# EAGLE design Color-Experimentation (EAGLE 9.6.2)
Assembly variants: DEFAULT
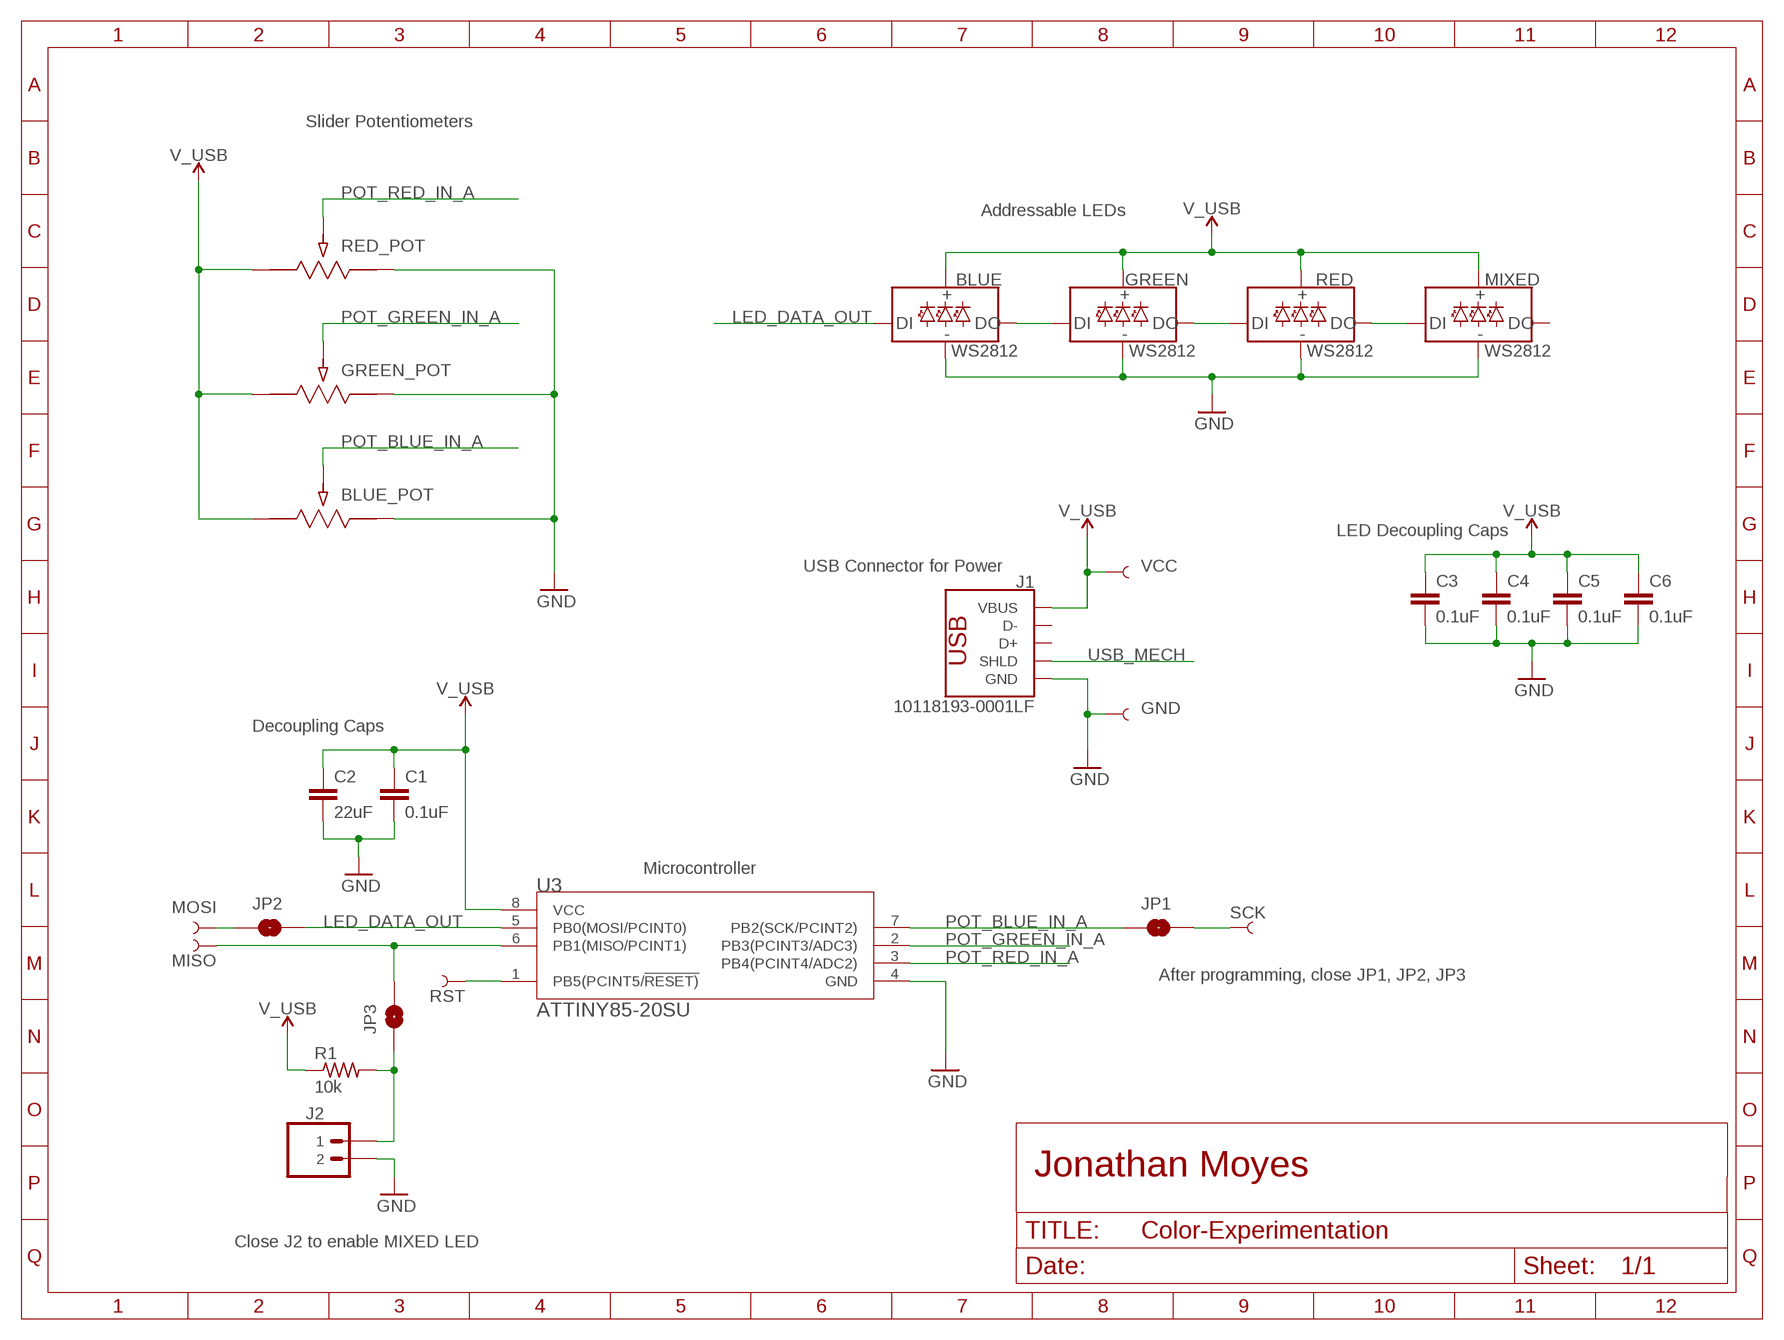
[diagram p0: schematic, sheet 1]

## Parts
BLUE  WS2812  WS2812_5050  [WS2812-5X5-4PIN]
BLUE_POT  10k  PTA2043-2015DPB103  [POT_PTA2043]
C1  0.1uF  CAP_0.1UF_25V_X7R-0603  [CAP_0603]
C2  22uF  CAP_22UF_16V_X5R-0603  [C0603]
C3  0.1uF  CAP_0.1UF_25V_X7R-0603  [CAP_0603]
C4  0.1uF  CAP_0.1UF_25V_X7R-0603  [CAP_0603]
C5  0.1uF  CAP_0.1UF_25V_X7R-0603  [CAP_0603]
C6  0.1uF  CAP_0.1UF_25V_X7R-0603  [CAP_0603]
GND  TEST-POINT40MIL  [TESTPOINT_40MIL_ROUND]  (not fitted in variant DEFAULT)
GREEN  WS2812  WS2812_5050  [WS2812-5X5-4PIN]
GREEN_POT  10k  PTA2043-2015DPB103  [POT_PTA2043]
J1  10118193-0001LF  [CONN_10118193-0001LF_AMP]
J2  CONN_02  [1X02]
JP1  JUMPER-SMT_2_NO_SILK  [SMT-JUMPER_2_NO_SILK]  (not fitted in variant DEFAULT)
JP2  JUMPER-SMT_2_NO_SILK  [SMT-JUMPER_2_NO_SILK]  (not fitted in variant DEFAULT)
JP3  JUMPER-SMT_2_NO_SILK  [SMT-JUMPER_2_NO_SILK]
MISO  TEST-POINT40MIL  [TESTPOINT_40MIL_ROUND]  (not fitted in variant DEFAULT)
MIXED  WS2812  WS2812_5050  [WS2812-5X5-4PIN]
MOSI  TEST-POINT40MIL  [TESTPOINT_40MIL_ROUND]  (not fitted in variant DEFAULT)
R1  10k  RES_10K_1%R0603  [R0603]
RED  WS2812  WS2812_5050  [WS2812-5X5-4PIN]
RED_POT  10k  PTA2043-2015DPB103  [POT_PTA2043]
RST  TEST-POINT40MIL  [TESTPOINT_40MIL_ROUND]  (not fitted in variant DEFAULT)
SCK  TEST-POINT40MIL  [TESTPOINT_40MIL_ROUND]  (not fitted in variant DEFAULT)
U3  ATTINY85-20SU  [SOIC127P798X216-8N]
VCC  TEST-POINT40MIL  [TESTPOINT_40MIL_ROUND]  (not fitted in variant DEFAULT)

## Nets
GND [POWER]: BLUE.GND BLUE_POT.3 C1.2 C2.2 C3.2 C4.2 C5.2 C6.2 GND.P$1 GREEN.GND GREEN_POT.3 J1.5(GND) J2.1 MIXED.GND RED.GND RED_POT.3 U3.4(GND)
LED_DATA_OUT: BLUE.DI JP2.2 U3.5(PB0(MOSI/PCINT0))
MOSI: JP2.1 MOSI.P$1
N$1: BLUE.DO GREEN.DI
N$2: GREEN.DO RED.DI
N$3: J2.2 JP3.1 R1.2
N$4: RST.P$1 U3.1(PB5(PCINT5/!RESET))
N$5: MIXED.DI RED.DO
N$6: JP3.2 MISO.P$1 U3.6(PB1(MISO/PCINT1))
POT_BLUE_IN_A: BLUE_POT.WIPER JP1.1 U3.7(PB2(SCK/PCINT2))
POT_GREEN_IN_A: GREEN_POT.WIPER U3.2(PB3(PCINT3/ADC3))
POT_RED_IN_A: RED_POT.WIPER U3.3(PB4(PCINT4/ADC2))
SCK: JP1.2 SCK.P$1
USB_MECH: J1.4(SHLD) J1.6(SHLD) J1.7(SHLD) J1.8(SHLD) J1.9(SHLD) J1.S_1(SHLD) J1.S_1_H1(SHLD) J1.S_1_H2(SHLD) J1.S_2(SHLD) J1.S_2_H1(SHLD) J1.S_2_H2(SHLD)
V_USB [POWER]: BLUE.VCC BLUE_POT.1 C1.1 C2.1 C3.1 C4.1 C5.1 C6.1 GREEN.VCC GREEN_POT.1 J1.1(VBUS) MIXED.VCC R1.1 RED.VCC RED_POT.1 U3.8(VCC) VCC.P$1
Unconnected: J1.2(D-) J1.3(D+) MIXED.DO

## Notes on the sheet
- Slider Potentiometers
- Addressable LEDs
- LED Decoupling Caps
- USB Connector for Power
- Decoupling Caps
- Microcontroller
- After programming, close JP1, JP2, JP3
- Jonathan Moyes
- Close J2 to enable MIXED LED

## Library data of the parts
BLUE GREEN MIXED RED = Color-Experimentation:WS2812: Addressable RGB LED - 1 Wire Common names: WS2812, SK6812, Neopixel, APA-106, etc. SMD LED with built-in controller IC. Color: Red/Green/Blue SparkFun Products: LED-SMD RGB (WS2812) <https://www.sparkfun.com/products/11821> LED - RGB Addressable, PTH, 5mm Diffused (5 Pack) <https://www.sparkfun.com/products/12986> LED - RGB Addressable, PTH, 5mm Clear (5 Pack) <https://www.sparkfun.com/products/12999> Blynk Board - ESP8266 <https://www.sparkfun.com/products/13794> Datasheet referenced for footprint: WS2812B-PTH <https://cdn.sparkfun.com/datasheets/Components/LED/COM-12877.pdf>; MFG: SparkFun.com; MPN: WS2812B 5050
BLUE_POT GREEN_POT RED_POT = Color-Experimentation:PTA2043-2015DPB103: 10 kOhms 0.1W, 1/10W Through Hole Slide Potentiometer Top Adjustment Type; MFG: Bourns Inc.; MPN: PTA2043-2015DPB103
C1 C3-C6 = Color-Experimentation:CAP_0.1UF_25V_X7R: 0.1µF ±10% 25V Ceramic Capacitor X7R; MFG: Samsung Electro-Mechanics; MPN: CL10B104KA8WPNC
C2 = Color-Experimentation:CAP_22UF_16V_X5R: 22µF ±20% 16V Ceramic Capacitor X5R 0805 (2012 Metric); MFG: Samsung Electro-Mechanics; MPN: CL21A226MOQNNNE
GND MISO MOSI RST SCK VCC = Color-Experimentation:TEST-POINT: 40mil Diameter Round Test Point
J1 = Color-Experimentation:10118193-0001LF; MFG: Amphenol ICC; MPN: 10118193-0001LF
J2 = Color-Experimentation:CONN_02: 0.1" Header - 2 pin, 1 row; MFG: Amazon.com; MPN: B07PWZ6G9G
JP1-JP3 = Color-Experimentation:JUMPER-SMT_2_NO: Normally Open solder jumper
R1 = Color-Experimentation:RES_10K_1%: 10 kOhms ±1% 0.1W, 1/10W Chip Resistor 0603 (1608 Metric) Thick Film; MFG: Yageo; MPN: RC0603FR-0710KL
U3 = Color-Experimentation:ATTINY85-20SU: AVR AVR® ATtiny, Functional Safety (FuSa) Microcontroller IC 8-Bit 20MHz 8KB (4K x 16) FLASH 8-SOIC; DESCRIPTION: AVR AVR® ATtiny, Functional Safety (FuSa) Microcontroller IC 8-Bit 20MHz 8KB (4K x 16) FLASH 8-SOIC; DIGI-KEY_PART_NUMBER: ATTINY85-20SU-ND; MF: Microchip; MP: ATTINY85-20SU; PACKAGE: SOIC-8 Microchip; PURCHASE-URL: https://pricing.snapeda.com/search/part/ATTINY85-20SU/?ref=eda

## Net classes
1 POWER: width 0.508 mm, drill 0.381 mm

## Board
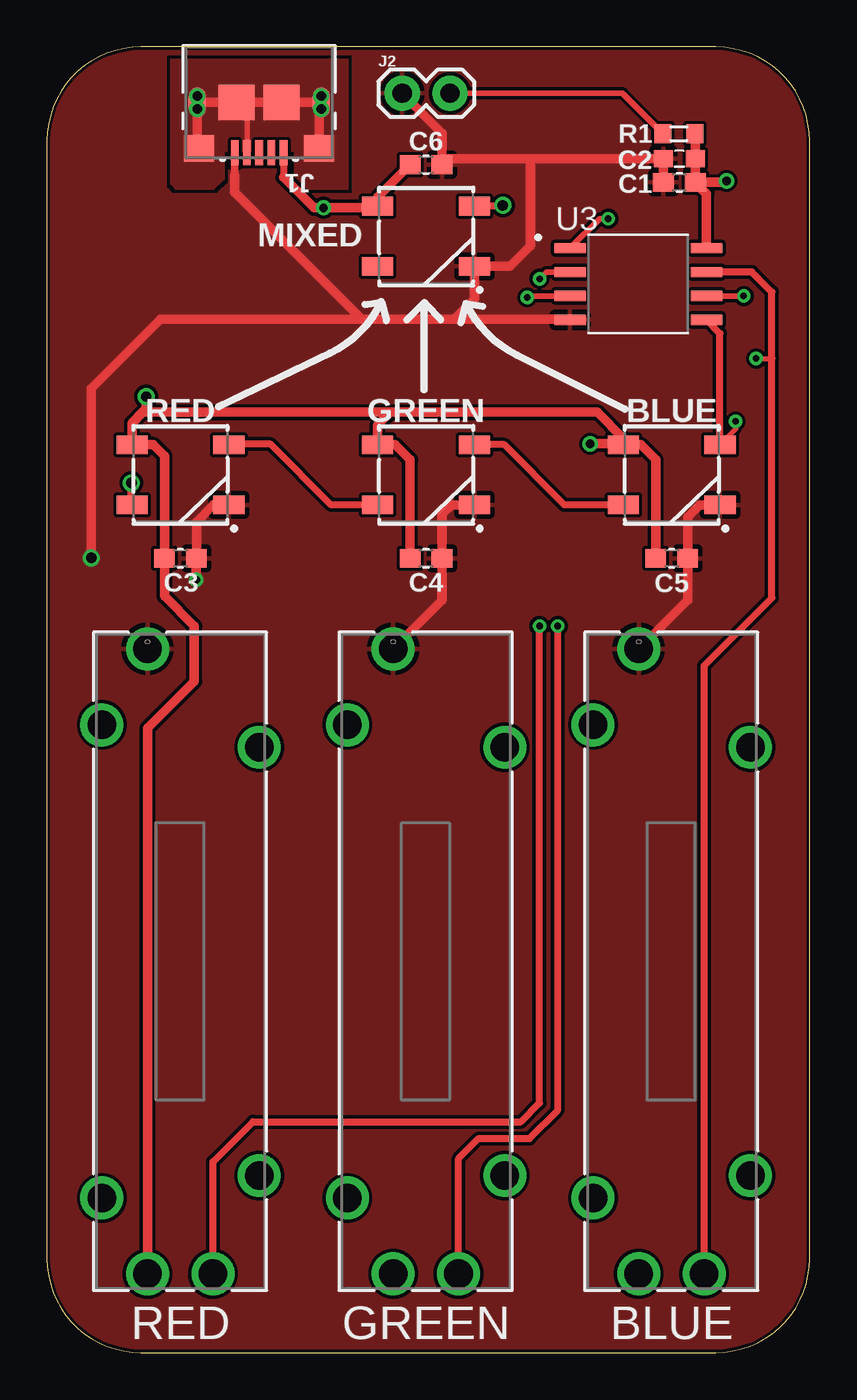
[diagram p1: board, top side]
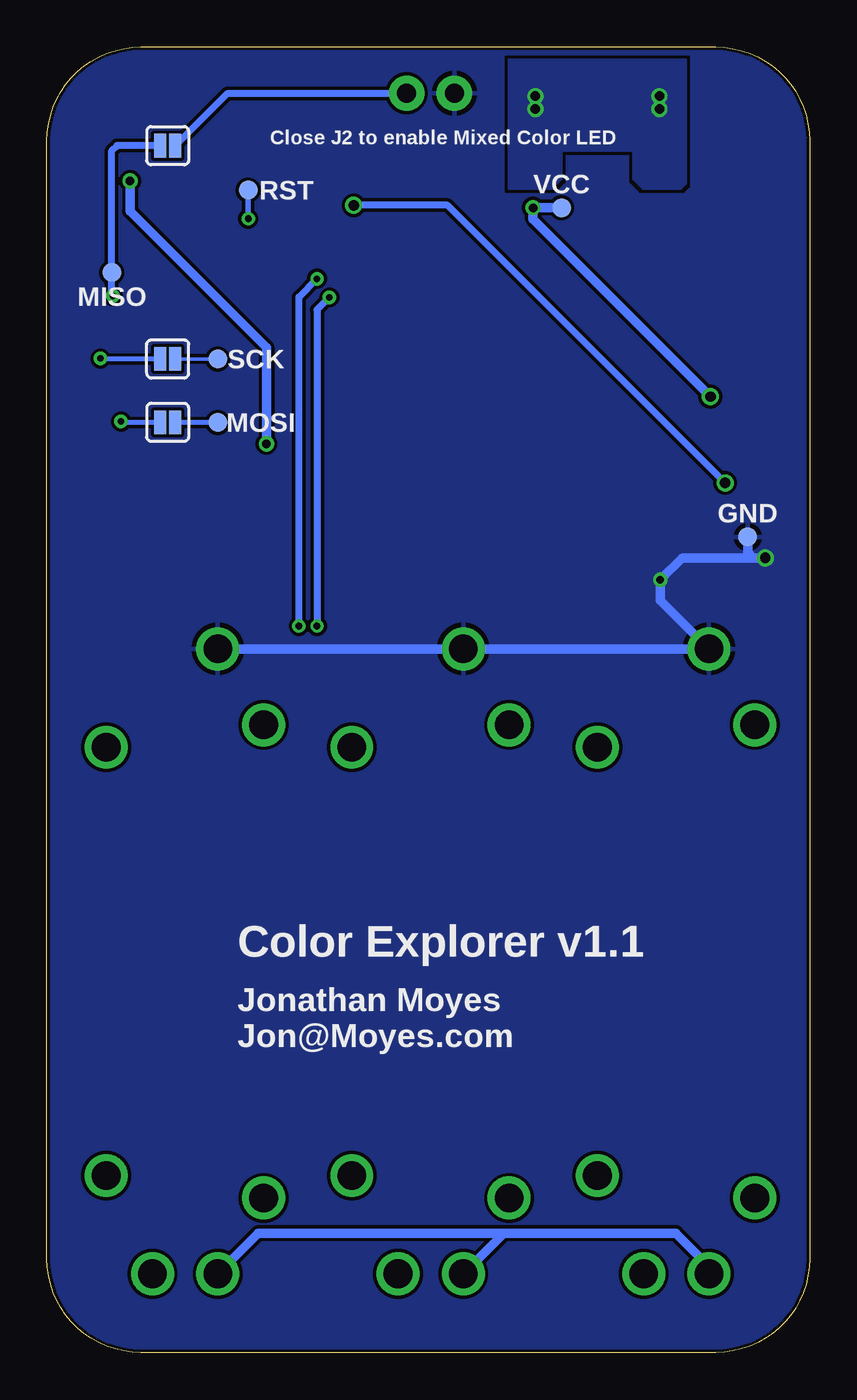
[diagram p2: board, bottom side, seen from below]

Size 40.62 x 69.52 mm. Coordinates in mm from the lower left corner, seen from the top.
Outline: 40.62,5 40.62,64.52 arc90 35.62,69.52 5,69.52 arc90 0,64.52 0,5 arc90 5,0 35.62,0 arc90 40.62,5
Copper layers (1*16): Top 0.035mm / dielectric 1.5mm / Bottom 0.035mm
Design rules "SparkFun-2-Layer-General-JLCPCB": minimum track width 7mil, minimum drill 0.3mm, track to track 7mil, track to pad 7mil, pad to pad 7mil, via to via 7mil, smd to smd 7mil, copper to edge 7mil, drill to drill 7mil, minimum pad ring 7mil, minimum via ring 7mil, stop-mask expansion 3mil, vias tented up to drill 25mil, thermal gap 10mil

### Footprints (pad centres in the part's own frame; a part is rotated, then mirrored left to right if it is on the bottom)
WS2812-5X5-4PIN = smd 1.651 x 1: DI 2.577,1.6; DO -2.577,-1.6; GND 2.577,-1.6; VCC -2.577,1.6
POT_PTA2043 = drill 1.524 pad 2.032: 1 -1.753,-16.637; 3 -1.753,16.637; MECH@1 -4.191,-12.598; MECH@2 4.191,-11.405; MECH@3 4.191,11.405; MECH@4 -4.191,12.598; WIPER 1.727,-16.637
CAP_0603 = smd 1.1 x 1: 1 -0.85,0; 2 0.85,0
C0603 = smd 1 x 0.9: 1 -0.85,0; 2 0.85,0
TESTPOINT_40MIL_ROUND = smd 1.016 x 1.016: P$1 0,0
CONN_10118193-0001LF_AMP = smd 0.406 x 1.346: 1 -1.3,2.659; 2 -0.65,2.659; 3 0,2.659; 4 0.65,2.659; 5 1.3,2.659 | smd 1.6 x 1.397: 6 -3.2,2.434; 7 3.2,2.434 | smd 1.905 x 1.905: 8 -1.2,-0.016; 9 1.2,-0.016 | smd 0.914 x 1.6: S_1 -3.3,-0.016; S_2 3.3,-0.016 | drill 0.508 pad 0.508: S_1_H1 -3.302,0.33; S_1_H2 -3.302,-0.356; S_2_H1 3.302,0.33; S_2_H2 3.302,-0.356
1X02 = drill 1.016 pad 1.88: 1 0,0; 2 2.54,0
SMT-JUMPER_2_NO_SILK = smd 0.635 x 1.27: 1 -0.406,0; 2 0.406,0
R0603 = smd 0.9 x 1: 1 -0.85,0; 2 0.85,0
SOIC127P798X216-8N = smd 1.71 x 0.58: 1 -3.63,1.905; 2 -3.63,0.635; 3 -3.63,-0.635; 4 -3.63,-1.905; 5 3.63,-1.905; 6 3.63,-0.635; 7 3.63,0.635; 8 3.63,1.905

### Placement (x,y rotation side)
BLUE  33.27,46.74 0 top
BLUE_POT  33.27,20.83 0 top
C1  33.68,62.31 180 top
C2  33.68,63.58 180 top
C3  7.11,42.29 0 top
C4  20.19,42.29 0 top
C5  33.27,42.29 0 top
C6  20.19,63.25 0 top
GND  3.3,43.43 0 bottom
GREEN  20.19,46.74 0 top
GREEN_POT  20.19,20.83 0 top
J1  11.3,66.55 180 top
J2  18.92,67.06 0 top
JP1  34.19,52.91 0 bottom
JP2  34.19,49.53 180 bottom
JP3  34.19,64.26 180 bottom
MISO  37.16,57.51 0 bottom
MIXED  20.19,59.44 0 top
MOSI  31.52,49.53 0 bottom
R1  33.66,64.9 180 top
RED  7.11,46.74 0 top
RED_POT  7.11,20.83 0 top
RST  29.9,61.9 0 bottom
SCK  31.52,52.91 0 bottom
U3  31.5,56.9 0 top
VCC  13.21,60.96 0 bottom

### Tracks (layer width: path | path; a pad name or v marks a point on that pad's centre or on a via)
GND  (via drill 0.4, 0.55)
  Top 0.406: J1.5 10,62.69
  Top 0.508: C1.2 C2.2 25.76,63.58 | 16.76,55.02 21.69,55.02 | 21.69,55.02 22.77,56.09 MIXED.GND 24.66,57.84 25.76,58.93 25.76,63.58 | v2.36,42.32 2.36,51.33 6.04,55.02 16.76,55.02 | RED.GND 9.66,45.16 8.89,45.16 7.96,44.23 C3.2 v7.95,41.15 | GREEN.GND 21.51,45.14 21.04,44.66 C4.2 21.04,40.07 GREEN_POT.3 | BLUE.GND 34.77,45.14 34.12,44.49 C5.2 34.12,40.07 BLUE_POT.3 | 25.76,63.58 21.37,63.58 C6.2 21.04,64.94 J2.1 | 10,62.69 10,61.78 16.76,55.02 | U3.4 27.84,55.02 21.69,55.02
  Bottom 0.508: v2.36,42.32 3.02,42.32 | 3.02,42.32 6.78,42.32 v7.95,41.15 7.95,40.06 RED_POT.3 GREEN_POT.3 BLUE_POT.3 | GND.P$1 3.3,42.6 3.02,42.32
  pour Top (rank 2): -1.02,71.12 41.66,71.12 41.66,-1.02 -1.02,-1.02
  pour Bottom (rank 2): -1.02,71.12 41.66,71.12 41.66,-1.02 -1.02,-1.02
LED_DATA_OUT  (via drill 0.35)
  Top 0.254: v36.68,49.58 36.68,49.16 BLUE.DI
  Top 0.381: U3.5 35.85,54.27 BLUE.DI
  Bottom 0.254: JP2.2 36.63,49.53 v36.68,49.58
MOSI
  Bottom 0.254: MOSI.P$1 JP2.1
N$1
  Top 0.381: BLUE.DO 27.56,45.14 24.36,48.34 GREEN.DI | GREEN.DI
N$2
  Top 0.381: GREEN.DO 15.14,45.14 11.91,48.36 9.71,48.36 RED.DI
N$3
  Top 0.305: R1.2 30.65,67.06 J2.2
  Bottom 0.381: J2.2 30.99,67.06 JP3.1
N$4  (via drill 0.35)
  Top 0.305: U3.1 29.44,60.38 v29.9,60.38
  Bottom 0.254: 30,61.9 RST.P$1
  Bottom 0.305: v29.9,60.38 29.9,61.8 30,61.9
N$5  (via drill 0.55)
  Top 0.381: RED.DO 4.5,45.17 v4.5,46.3 | v24.28,61.09 24.23,61.04 MIXED.DI
  Bottom 0.381: v4.5,46.3 19.28,61.09 v24.28,61.09
N$6  (via drill 0.35)
  Top 0.305: U3.6 v37.11,56.26
  Bottom 0.254: MISO.P$1 37.16,56.31 v37.11,56.26
  Bottom 0.381: v37.11,56.26 37.19,56.34 37.19,63.96 36.88,64.26 JP3.2
POT_BLUE_IN_A  (via drill 0.35)
  Top 0.254: v37.77,52.93 38.61,52.93
  Top 0.381: BLUE_POT.WIPER 35,36.58 38.61,40.18 38.61,52.93 38.61,56.46 37.54,57.53 U3.7
  Bottom 0.254: JP1.1 37.74,52.91 v37.77,52.93
POT_GREEN_IN_A  (via drill 0.35)
  Top 0.305: v26.24,57.17 26.59,57.53 U3.2
  Top 0.381: GREEN_POT.WIPER 21.92,10.34 22.99,11.4 25.7,11.4 27.2,12.9 v27.2,38.68
  Bottom 0.381: v27.2,38.68 27.2,56.21 v26.24,57.17
POT_RED_IN_A  (via drill 0.35)
  Top 0.305: U3.3 25.65,56.26 v25.58,56.19
  Top 0.381: RED_POT.WIPER 8.84,10.16 10.97,12.29 25.25,12.29 26.24,13.28 v26.24,38.68
  Bottom 0.381: v25.58,56.19 26.24,55.52 v26.24,38.68
SCK
  Bottom 0.178: SCK.P$1 JP1.2
USB_MECH
  Top 0.305: J1.4 10.65,65.79 9.88,66.56
  Top 0.508: J1.9 J1.8 J1.S_1 14.5,66.46 J1.6 | 9.88,66.56 J1.9 | J1.9 J1.S_2 8,64.21 J1.7
  pour Top (no thermals): 16,68.83 16,61.98 13.72,61.98 13.21,62.48 13.21,64.01 9.4,64.01 9.4,62.48 8.89,61.98 6.86,61.98 6.6,62.23 6.6,68.83
  pour Bottom (no thermals): 16,68.83 16,61.98 13.72,61.98 13.21,62.48 13.21,64.01 9.4,64.01 9.4,62.48 8.89,61.98 6.86,61.98 6.6,62.23 6.6,68.83
V_USB  (via drill 0.45, 0.55)
  Top 0.381: J1.1 12.6,62.58
  Top 0.508: RED_POT.1 5.36,33.25 7.85,35.74 7.85,38.68 6.26,40.27 C3.1 6.26,47.74 5.66,48.34 RED.VCC 4.54,49.49 5.11,50.06 | C1.1 C2.1 34.53,64.87 R1.1 | C5.1 32.42,47.53 31.62,48.34 BLUE.VCC | C4.1 19.34,47.53 18.54,48.34 GREEN.VCC 17.62,49.39 18.29,50.06 | BLUE.VCC 30.7,48.68 29.31,50.06 18.29,50.06 | 5.11,50.06 18.29,50.06 | 5.11,50.06 5.28,50.24 v5.28,50.9 | C1.1 36.12,62.31 v36.2,62.38 | v28.93,48.39 30.65,48.39 BLUE.VCC | 12.6,62.58 14.22,60.96 v14.73,60.96 17.54,60.96 MIXED.VCC 17.62,61.52 C6.1 | U3.8 35.13,61.71 C1.1
  Bottom 0.508: 16.28,6.35 7.11,6.35 5.36,4.6 RED_POT.1 | 16.28,6.35 GREEN_POT.1 | 16.28,6.35 29.36,6.35 BLUE_POT.1 | v36.2,62.38 36.2,60.78 28.93,53.52 v28.93,48.39 | VCC.P$1 v14.73,60.96 14.73,60.35 v5.28,50.9

### Text on the board
tPlace: RED | GREEN | BLUE
bPlace: Close J2 to enable Mixed Color LED | Color Explorer v1.1 | Jonathan Moyes / Jon@Moyes.com